# Altium schematic sheet Motor_Drive_1.SchDoc
size B; PageSetup: Record=PageOptions|CenterHorizontal=True|CenterVertical=True|PrintScale=1.09|XCorrection=1.00|YCorrection=1.00|PrintKind=2|BorderSize=5000000|LeftOffset=0|BottomOffset=0|Orientation=2|PaperLength=1000|PaperWidth=1000|Scale=100|PaperSource=261|PrintQuality=600|MediaType=1|DitherType=10|PaperKind=11x17|PrintScaleMode=1
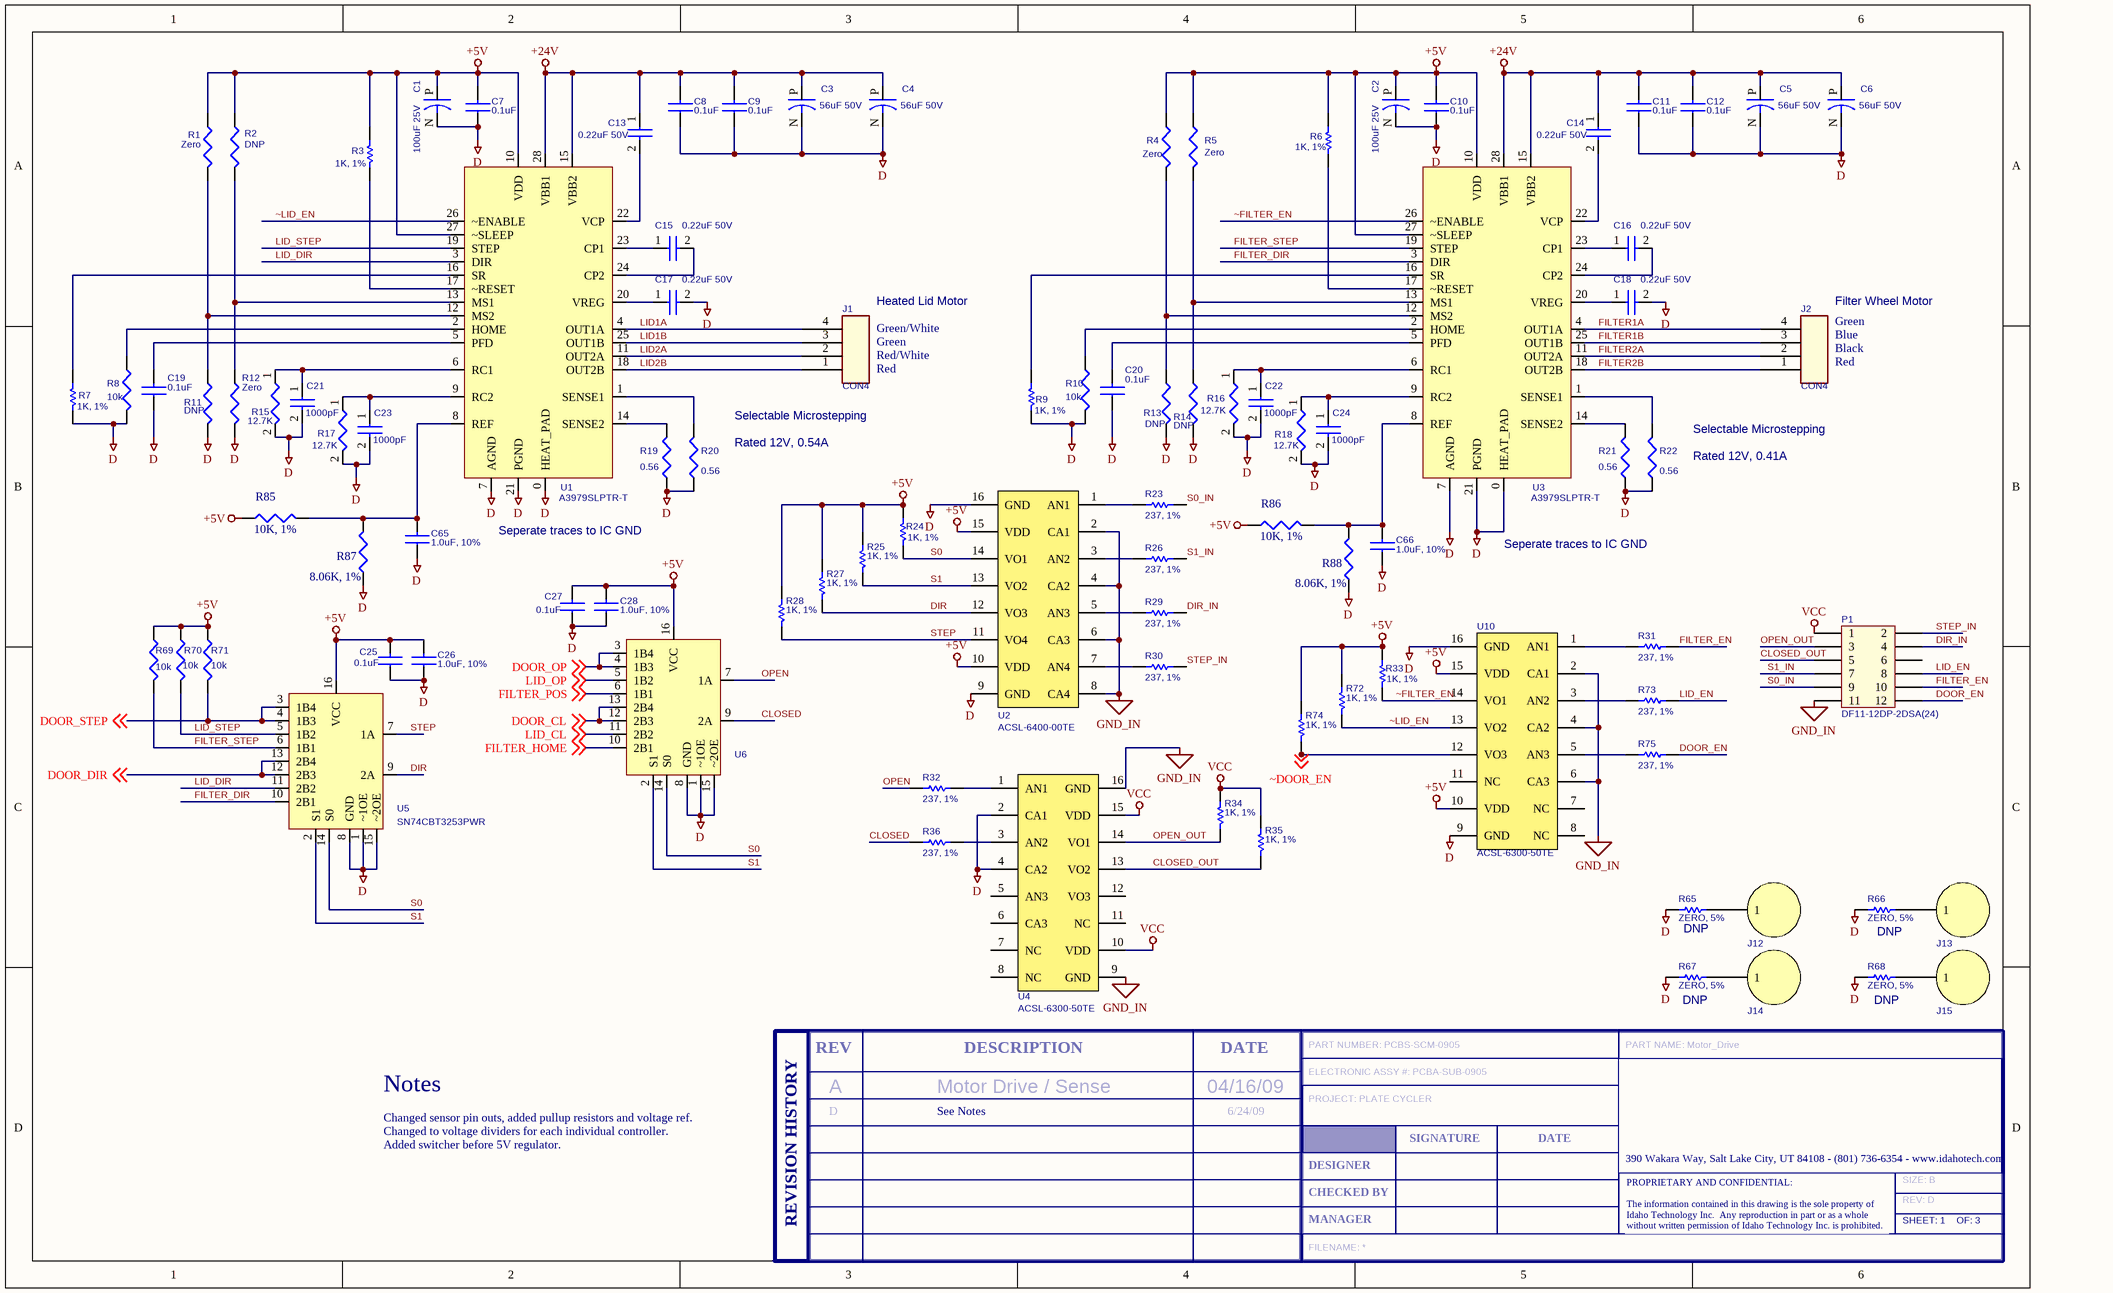
[diagram p0: Motor_Drive_1.SchDoc]

## Parts
C1  100uF 25V  [SM/CT_7360]
C2  100uF 25V  [SM/CT_7360]
C3  56uF 50V  [CPCYL/D.250/LS.100/.031]
C4  56uF 50V  [CPCYL/D.250/LS.100/.031]
C5  56uF 50V  [CPCYL/D.250/LS.100/.031]
C6  56uF 50V  [CPCYL/D.250/LS.100/.031]
C7  0.1uF  [SM/C_0603]
C8  0.1uF  [SM/C_0603]
C9  0.1uF  [SM/C_0603]
C10  0.1uF  [SM/C_0603]
C11  0.1uF  [SM/C_0603]
C12  0.1uF  [SM/C_0603]
C13  0.22uF 50V  [SM/C_0603]
C14  0.22uF 50V  [SM/C_0603]
C15  0.22uF 50V  [SM/C_0603]
C16  0.22uF 50V  [SM/C_0603]
C17  0.22uF 50V  [SM/C_0603]
C18  0.22uF 50V  [SM/C_0603]
C19  0.1uF  [SM/C_0603]
C20  0.1uF  [SM/C_0603]
C21  1000pF  [SM/C_0603]
C22  1000pF  [SM/C_0603]
C23  1000pF  [SM/C_0603]
C24  1000pF  [SM/C_0603]
C25  0.1uF  [SM/C_0603]
C26  1.0uF, 10%  [SM/C_0603]
C27  0.1uF  [SM/C_0603]
C28  1.0uF, 10%  [SM/C_0603]
C65  1.0uF, 10%  [SM/C_0603]
C66  1.0uF, 10%  [SM/C_0603]
J1  CON4  [MOLEX4]
J2  CON4  [MOLEX4]
J12  MOUNTING_HOLE_1  [6/32 Mounting Hole]  (value not drawn)  (no BOM)
J13  MOUNTING_HOLE_1  [6/32 Mounting Hole]  (value not drawn)  (no BOM)
J14  MOUNTING_HOLE_1  [6/32 Mounting Hole]  (value not drawn)  (no BOM)
J15  MOUNTING_HOLE_1  [6/32 Mounting Hole]  (value not drawn)  (no BOM)
P1  Manufacturer P/N: DF11-12DP-2DSA(24)  [HEADER_2X6_1]  (hidden comment: HEADER_2X6_1)
R1  Zero  [SM/R_0603]
R2  DNP  [SM/R_0603]  (no BOM)
R3  value 1K, 1%  [0603]  (hidden comment: Res1)
R4  Zero  [SM/R_0603]
R5  Zero  [SM/R_0603]
R6  value 1K, 1%  [0603]  (hidden comment: Res1)
R7  value 1K, 1%  [0603]  (hidden comment: Res1)
R8  10k  [SM/R_0603]
R9  value 1K, 1%  [0603]  (hidden comment: Res1)
R10  10k  [SM/R_0603]
R11  DNP  [SM/R_0603]  (no BOM)
R12  Zero  [SM/R_0603]
R13  DNP  [SM/R_0603]  (no BOM)
R14  DNP  [SM/R_0603]  (no BOM)
R15  12.7K  [SM/R_0603]
R16  12.7K  [SM/R_0603]
R17  12.7K  [SM/R_0603]
R18  12.7K  [SM/R_0603]
R19  0.56  [SM/R_2512]
R20  0.56  [SM/R_2512]
R21  0.56  [SM/R_2512]
R22  0.56  [SM/R_2512]
R23  value 237, 1%  [0603]  (hidden comment: Res1)
R24  value 1K, 1%  [0603]  (hidden comment: Res1)
R25  value 1K, 1%  [0603]  (hidden comment: Res1)
R26  value 237, 1%  [0603]  (hidden comment: Res1)
R27  value 1K, 1%  [0603]  (hidden comment: Res1)
R28  value 1K, 1%  [0603]  (hidden comment: Res1)
R29  value 237, 1%  [0603]  (hidden comment: Res1)
R30  value 237, 1%  [0603]  (hidden comment: Res1)
R31  value 237, 1%  [0603]  (hidden comment: Res1)
R32  value 237, 1%  [0603]  (hidden comment: Res1)
R33  value 1K, 1%  [0603]  (hidden comment: Res1)
R34  value 1K, 1%  [0603]  (hidden comment: Res1)
R35  value 1K, 1%  [0603]  (hidden comment: Res1)
R36  value 237, 1%  [0603]  (hidden comment: Res1)
R65  value ZERO, 5%  [0603]  (hidden comment: Res1)  (no BOM)
R66  value ZERO, 5%  [0603]  (hidden comment: Res1)  (no BOM)
R67  value ZERO, 5%  [0603]  (hidden comment: Res1)  (no BOM)
R68  value ZERO, 5%  [0603]  (hidden comment: Res1)  (no BOM)
R69  10k  [SM/R_0603]
R70  10k  [SM/R_0603]
R71  10k  [SM/R_0603]
R72  value 1K, 1%  [0603]  (hidden comment: Res1)
R73  value 237, 1%  [0603]  (hidden comment: Res1)
R74  value 1K, 1%  [0603]  (hidden comment: Res1)
R75  value 237, 1%  [0603]  (hidden comment: Res1)
R85  10K, 1%  [SM/R_0603]
R86  10K, 1%  [SM/R_0603]
R87  8.06K, 1%  [SM/R_0603]
R88  8.06K, 1%  [SM/R_0603]
T??  SIZE: B  REV: D  PART NUMBER: PCBS-SCM-0905  PART NAME: Motor_Drive  ELECTRONIC ASSY #: PCBA-SUB-0905  PROJECT: PLATE CYCLER  SHEET: 1  OF: 3  (hidden comment: ITI Title Block, A Size)  (graphical)
U1  Manufacturer P/N: A3979SLPTR-T  [28-TSSOP_W_HEATPAD]  (hidden comment: STEPPER_CNTRL)
U2  Manufacturer P/N: ACSL-6400-00TE  [SO-16_SMALL_OUTLINE]  (hidden comment: OPTO_ISO_4)
U3  Manufacturer P/N: A3979SLPTR-T  [28-TSSOP_W_HEATPAD]  (hidden comment: STEPPER_CNTRL)
U4  Manufacturer P/N: ACSL-6300-50TE  [SO-16_SMALL_OUTLINE]  (hidden comment: OPTO_ISO_3_1DIRECTION)
U5  Manufacturer P/N: SN74CBT3253PWR  [16-TSSOP]  (hidden comment: 2X4:1_MUX_1)
U6  2X4:1_MUX_1  [16-TSSOP]  (value not drawn)
U10  Manufacturer P/N: ACSL-6300-50TE  [SO-16_SMALL_OUTLINE]  (hidden comment: OPTO_ISO_3_1DIRECTION)

## Nets
+5V: C1.P C2.P C7.2 C10.2 C25.2 C26.2 C27.2 C28.2 R1.1 R2.1 R3.2 R4.1 R5.1 R6.2 R24.2 R25.2 R27.2 R28.2 R33.2 R69.1 R70.1 R71.1 R72.2 R74.2 R85.1 R86.1 U1.10(VDD) U1.27(~SLEEP) U2.10(VDD) U2.15(VDD) U3.10(VDD) U3.27(~SLEEP) U5.16(VCC) U6.16(VCC) U10.10(VDD) U10.15(VDD)
+24V: C3.P C4.P C5.P C6.P C8.2 C9.2 C11.2 C12.2 C13.1 C14.1 U1.15(VBB2) U1.28(VBB1) U3.15(VBB2) U3.28(VBB1)
D: C1.N C2.N C3.N C4.N C5.N C6.N C7.1 C8.1 C9.1 C10.1 C11.1 C12.1 C17.2 C18.2 C19.1 C20.1 C21.2 C22.2 C23.2 C24.2 C25.1 C26.1 C27.1 C28.1 C65.1 C66.1 R7.1 R8.2 R9.1 R10.2 R11.2 R12.2 R13.2 R14.2 R15.2 R16.2 R17.2 R18.2 R19.1 R20.1 R21.1 R22.1 R65.2 R66.2 R67.2 R68.2 R87.1 R88.1 U1.0(HEAT_PAD) U1.7(AGND) U1.21(PGND) U2.9(GND) U2.16(GND) U3.0(HEAT_PAD) U3.7(AGND) U3.21(PGND) U4.2(CA1) U4.4(CA2) U5.1(~1OE) U5.8(GND) U5.15(~2OE) U6.1(~1OE) U6.8(GND) U6.15(~2OE) U10.9(GND) U10.16(GND)
GND_IN: P1.11 U2.2(CA1) U2.4(CA2) U2.6(CA3) U2.8(CA4) U4.9(GND) U4.16(GND) U10.2(CA1) U10.4(CA2) U10.6(CA3)
VCC: P1.1 R34.2 R35.2 U4.10(VDD) U4.15(VDD)
CLOSED: R36.2 U6.9(2A)
CLOSED_OUT: P1.5 R35.1 U4.13(VO2)
DIR: R27.1 U2.12(VO3) U5.9(2A)
DIR_IN: P1.4 R29.1
DOOR_CL: U6.12(2B3) U6.13(2B4) ; off-sheet DOOR_CL
DOOR_DIR: U5.12(2B3) U5.13(2B4) ; off-sheet DOOR_DIR
DOOR_EN: P1.12 R75.1
DOOR_OP: U6.3(1B4) U6.4(1B3) ; off-sheet DOOR_OP
DOOR_STEP: R71.2 U5.3(1B4) U5.4(1B3) ; off-sheet DOOR_STEP
FILTER1A: J2.4 U3.4(OUT1A)
FILTER1B: J2.3 U3.25(OUT1B)
FILTER2A: J2.2 U3.11(OUT2A)
FILTER2B: J2.1 U3.18(OUT2B)
FILTER_DIR: U3.3(DIR) U5.10(2B1)
FILTER_EN: P1.10 R31.1
FILTER_HOME: U6.10(2B1) ; off-sheet FILTER_HOME
FILTER_POS: U6.6(1B1) ; off-sheet FILTER_POS
FILTER_STEP: R69.2 U3.19(STEP) U5.6(1B1)
LID1A: J1.4 U1.4(OUT1A)
LID1B: J1.3 U1.25(OUT1B)
LID2A: J1.2 U1.11(OUT2A)
LID2B: J1.1 U1.18(OUT2B)
LID_CL: U6.11(2B2) ; off-sheet LID_CL
LID_DIR: U1.3(DIR) U5.11(2B2)
LID_EN: P1.8 R73.1
LID_OP: U6.5(1B2) ; off-sheet LID_OP
LID_STEP: R70.2 U1.19(STEP) U5.5(1B2)
OPEN: R32.2 U6.7(1A)
OPEN_OUT: P1.3 R34.1 U4.14(VO1)
S0: R24.1 U2.14(VO1) U5.14(S0) U6.14(S0)
S0_IN: P1.9 R23.1
S1: R25.1 U2.13(VO2) U5.2(S1) U6.2(S1)
S1_IN: P1.7 R26.1
STEP: R28.1 U2.11(VO4) U5.7(1A)
STEP_IN: P1.2 R30.1
~DOOR_EN: R74.1 U10.12(VO3) ; off-sheet ~DOOR_EN
~FILTER_EN: R33.1 U3.26(~ENABLE) U10.14(VO1)
~LID_EN: R72.1 U1.26(~ENABLE) U10.13(VO2)
NetC13_2: C13.2 U1.22(VCP)
NetC14_2: C14.2 U3.22(VCP)
NetC15_1: C15.1 U1.23(CP1)
NetC15_2: C15.2 U1.24(CP2)
NetC16_1: C16.1 U3.23(CP1)
NetC16_2: C16.2 U3.24(CP2)
NetC17_1: C17.1 U1.20(VREG)
NetC18_1: C18.1 U3.20(VREG)
NetC19_2: C19.2 U1.5(PFD)
NetC20_2: C20.2 U3.5(PFD)
NetC21_1: C21.1 R15.1 U1.6(RC1)
NetC22_1: C22.1 R16.1 U3.6(RC1)
NetC23_1: C23.1 R17.1 U1.9(RC2)
NetC24_1: C24.1 R18.1 U3.9(RC2)
NetC65_2: C65.2 R85.2 R87.2 U1.8(REF)
NetC66_2: C66.2 R86.2 R88.2 U3.8(REF)
NetJ12_1: J12.1 R65.1
NetJ13_1: J13.1 R66.1
NetJ14_1: J14.1 R67.1
NetJ15_1: J15.1 R68.1
NetR1_2: R1.2 R11.1 U1.12(MS2)
NetR2_2: R2.2 R12.1 U1.13(MS1)
NetR3_1: R3.1 U1.17(~RESET)
NetR4_2: R4.2 R13.1 U3.12(MS2)
NetR5_2: R5.2 R14.1 U3.13(MS1)
NetR6_1: R6.1 U3.17(~RESET)
NetR7_2: R7.2 U1.16(SR)
NetR8_1: R8.1 U1.2(HOME)
NetR9_2: R9.2 U3.16(SR)
NetR10_1: R10.1 U3.2(HOME)
NetR19_2: R19.2 U1.14(SENSE2)
NetR20_2: R20.2 U1.1(SENSE1)
NetR21_2: R21.2 U3.14(SENSE2)
NetR22_2: R22.2 U3.1(SENSE1)
NetR23_2: R23.2 U2.1(AN1)
NetR26_2: R26.2 U2.3(AN2)
NetR29_2: R29.2 U2.5(AN3)
NetR30_2: R30.2 U2.7(AN4)
NetR31_2: R31.2 U10.1(AN1)
NetR32_1: R32.1 U4.1(AN1)
NetR36_1: R36.1 U4.3(AN2)
NetR73_2: R73.2 U10.3(AN2)
NetR75_2: R75.2 U10.5(AN3)

Not connected (* = marked no-connect by the designer): P1 6; U4 5(AN3) 6(CA3) 7(NC) 8(NC) 11(NC) 12(VO3); U10 7(NC) 8(NC) 11(NC)

## Notes on the sheet
- (near J1) Heated Lid Motor
- (near J1) Red
- (near J1) Red/White
- (near J1) Green
- (near J1) Green/White
- (near J2) Filter Wheel Motor
- (near J2) Green
- (near J2) Blue
- (near J2) Black
- (near J2) Red
- Selectable Microstepping
- (near R20) Rated 12V, 0.54A
- (near R22) Rated 12V, 0.41A
- Seperate traces to IC GND
- (near R65) DNP
- (near R66) DNP
- (near R67) DNP
- (near R68) DNP
- Notes
- A
- Motor Drive / Sense
- 04/16/09
- Changed sensor pin outs, added pullup resistors and voltage ref.
- Changed to voltage dividers for each individual controller.
- Added switcher before 5V regulator.
- D
- See Notes
- 6/24/09
- (in symbol ITI A-size Title Block and Rev Table) REV; DESCRIPTION; DATE; SIGNATURE; 390 Wakara Way, Salt Lake City, UT 84108 - (801) 736-6354 - www.idahotech.com; DESIGNER; CHECKED BY; REVISION HISTORY; MANAGER; PROPRIETARY AND CONFIDENTIAL: / The information contained in this drawing is the sole property of / Idaho Technology Inc.  Any reproduction in part or as a whole / without written permission of Idaho Technology Inc. is prohibited.

## Library data of the parts
C1 C2 = CAP_1: CAP TANT 100UF 25V 20% SMD; Manufacturer: Kemet; Manufacturer P/N: T510E107M025AT E050; Vendor: Digikey; Vendor P/N: 399-3989-1-ND; Description: CAPACITOR TANT 100UF 25V 20% SMD
C3-C6 = CAP_1: CAP 56UF 50V ELECT FC RADIAL; Manufacturer P/N: EEU-FC1H560; Manufacturer: Panasonic; Vendor P/N: P10322-ND; Vendor: Digikey
C7-C12 C19 C20 C25 C27 = CAP NP_Dup1: CAP CER .10UF 50V X7R 0603; Manufacturer: Taiyo Yuden; Manufacturer P/N: UMK107B7104KA-T; Vendor: Digikey; Vendor P/N: 587-1243-1-ND
C13-C18 = CAP NP_1: CAP CER .22UF 50V Y5V 0603; Manufacturer: Murata Electronics North America; Manufacturer P/N: GRM188F51H224ZA01D; Vendor P/N: 490-1569-1-ND; Vendor: Digikey
C21-C24 = CAP NP_1: CAP 1000PF 50V CERAMIC X7R 0603; Manufacturer P/N: ECJ-1VB1H102K; Manufacturer: Panasonic - ECG; Vendor P/N: PCC1772CT-ND; Vendor: Digikey
C26 C28 C65 C66 = CAP NP_Dup1: CAP CER 1.0UF 10V X5R 10% 0603; Manufacturer: TDK Corporation; Manufacturer P/N: C1608X5R1A105K; Vendor: DIGIKEY; Vendor P/N: 445-1321-1-ND
J1 J2 = CON4: CONN HEADER 4POS .100 VERT GOLD; Manufacturer: Molex/Waldom Electronics Corp; Manufacturer P/N: 70543-0003; Vendor P/N: WM4802-ND; Vendor: Digikey
J12 = MOUNTING_HOLE_1: Description: CAP CER .33UF 50V X7R 0805
J13 J14 = MOUNTING_HOLE_1: Description: CAPACITOR TANT 100UF 25V 20% SMD
J15 = MOUNTING_HOLE_1: Description: CAP 56UF 50V ELECT FC RADIAL
P1 = HEADER_2X6_1: CONN HEADER 12POS 2MM PCB TIN; Manufacturer: HIROSE; Vendor: DIGIKEY; Vendor P/N: H10233-ND; Price: 0.72
R1 R2 R4 R5 R11-R14 = R: RES 0.0 OHM 1/10W 5% 0603 SMD; Manufacturer P/N: MCR03EZPJ000; Manufacturer: ROHM SEMICONDUCTOR; Vendor P/N: RHM0.0GCT-ND; Vendor: DIGIKEY; Price: 0.069
R3 R6 R7 R9 R24 R25 R27 R28 R33-R35 R72 R74 = Res1: RES 1.00K OHM 1/10W 1% 0603 SMD; Manufacturer: PANASONIC - ECG; Manufacturer P/N: ERJ-3EKF1001V; Vendor: DIGIKEY; Vendor P/N: P1.00KHCT-ND; IT P/N: N/A; Price: 0.73
R8 R10 R69-R71 = R: RES 10K OHM 1/10W 5% 0603 SMD; Manufacturer P/N: ERJ-3GEYJ103V; Manufacturer: Panasonic; Vendor P/N: P10KGCT-ND; Vendor: Digikey
R15-R18 = RESISTOR_0_Dup1: RES 12.7K OHM 1/10W 1% 0603 SMD; Manufacturer P/N: ERJ-3EKF1272V; Manufacturer: Panasonic; Vendor P/N: P12.7KHCT-ND; Vendor: Digikey
R19-R22 = RESISTOR: RES .56 OHM 1W 1% 2512 SMD; Manufacturer P/N: ERJ-1TRQFR56U; Manufacturer: Panasonic; Vendor P/N: PT.56YCT-ND; Vendor: Digikey
R23 R26 R29-R32 R36 R73 R75 = Res1: RES 237 OHM 1/10W 1% 0603 SMD; Manufacturer: PANASONIC - ECG; Manufacturer P/N: ERJ-3EKF2370V; Vendor: DIGIKEY; Vendor P/N: P237HCT-ND; IT P/N: N/A; Price: 0.073
R65-R68 = Res1: RES 0.0 OHM 1/10W 5% 0603 SMD; Manufacturer: ROHM SEMICONDUCTOR; Manufacturer P/N: MCR03EZPJ000; Vendor: DIGIKEY; Vendor P/N: RHM0.0GCT-ND; IT P/N: N/A; Price: 0.069
R85 R86 = Res3: RES 10.0K OHM 1/10W 1% 0603 SMD; Manufacturer: Panasonic; Manufacturer P/N: ERJ-3EKF1002V; Vendor: Digikey; Vendor P/N: P10.0KHCT-ND
R87 R88 = Res3: RES 8.06K OHM 1/10W 1% 0603 SMD; Manufacturer: Panasonic; Manufacturer P/N: ERJ-3EKF8061V; Vendor: Digikey; Vendor P/N: P8.06KHCT-ND; Price: 0.73
T?? = ITI A-size Title Block and Rev Table: ITI Title Block and Rev Table, A Size; FILENAME: *
U1 U3 = STEPPER_CNTRL: IC DRIVER MICROSTEPPING 28-TSSOP; Manufacturer: ALLEGRO; Vendor P/N: 620-1148-1-ND; Vendor: DIGIKEY
U2 = OPTO_ISO_4: OPTOCOUPLER QUAD 15MBD 16-SOIC; Manufacturer: AVAGO TECHNOLOGIES; Vendor: DIGIKEY; Vendor P/N: 516-1603-5-ND; Price: 7.00
U4 U10 = OPTO_ISO_3_1DIRECTION: Optocouplers 3.0V - 5.5V 15MBd; Manufacturer: AVAGO TECHNOLOGIES; Vendor: MOUSER ELECTRONICS; Vendor P/N: 630-ACSL-6300-50TE; Price: 4.77
U5 = 2X4:1_MUX_1: IC DUAL 1OF4 MUX/DEMUX 16TSSOP; Manufacturer: TEXAS INSTRUMENTS; Vendor: DIGIKEY; Vendor P/N: 296-1167-1-ND; Price: 0.64
U6 = 2X4:1_MUX_1: IC DUAL 1OF4 MUX/DEMUX 16TSSOP; Manufacturer: TEXAS INSTRUMENTS; Manufacturer P/N: SN74CBT3253PWR; Vendor: DIGIKEY; Vendor P/N: 296-1167-1-ND; Price: 0.64